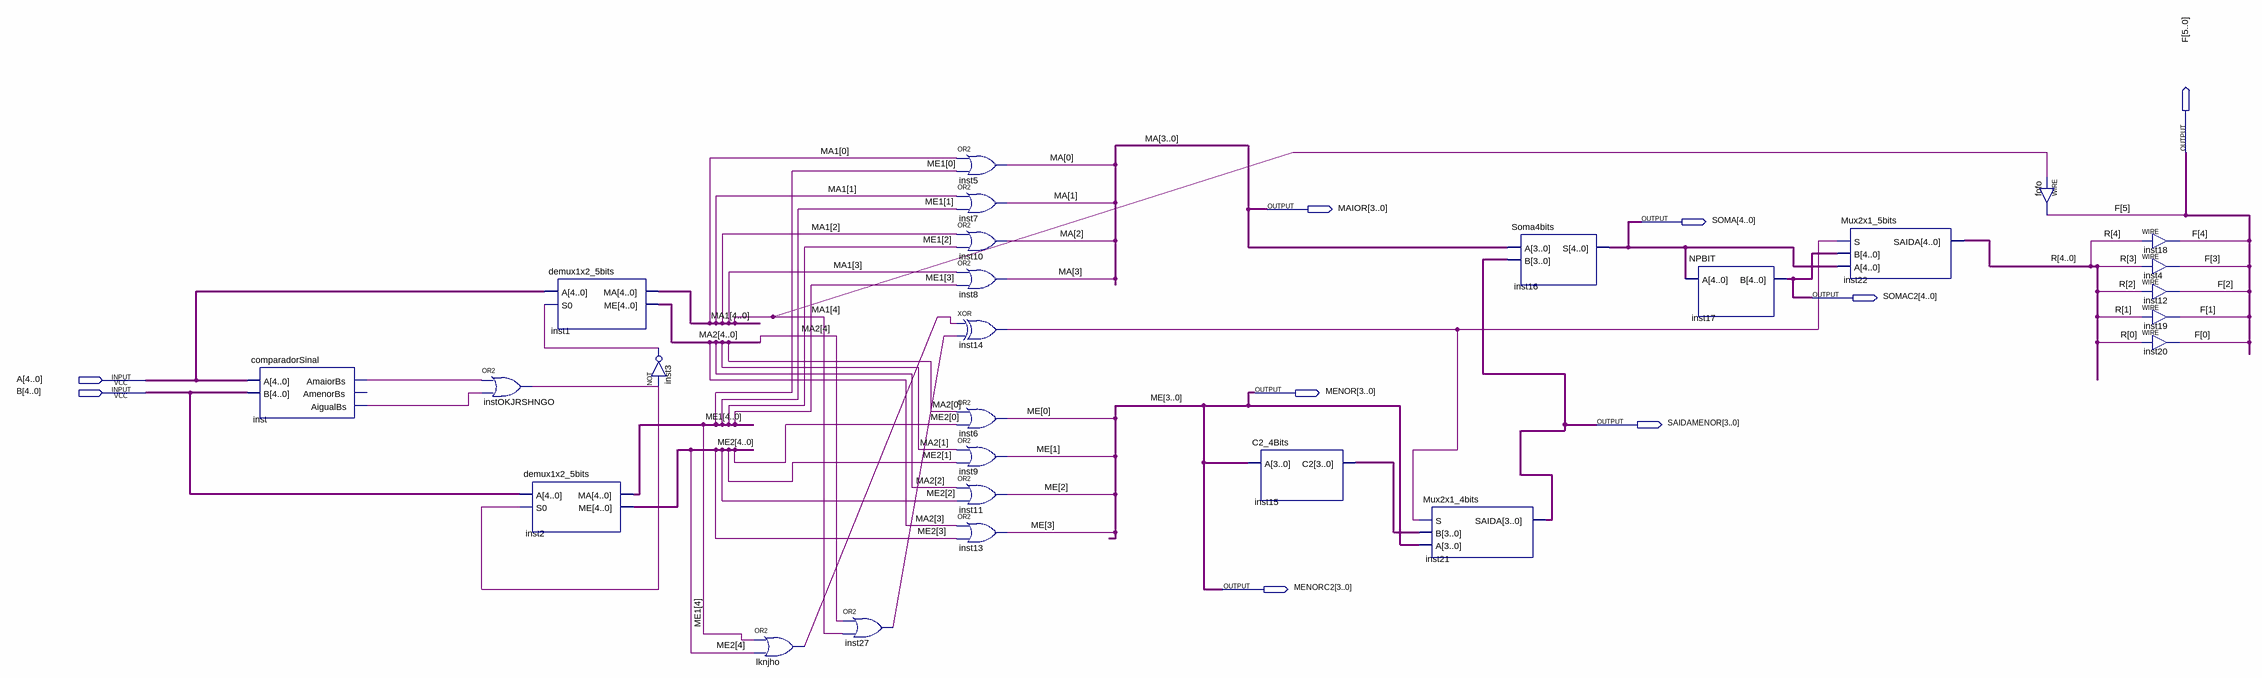
[diagram p0: schematic sheet]
// Quartus schematic Somador.bdf as structural Verilog: 27 symbols, 9 pins
module Somador (
  input  [4:0] A,
  input  [4:0] B,
  output [5:0] F,
  output [3:0] MAIOR,
  output [4:0] SOMA,
  output [4:0] SOMAC2,
  output [3:0] MENOR,
  output [3:0] SAIDAMENOR,
  output [3:0] MENORC2
);

  wire inst3_out, inst14_out, inst27_out, inst_aigualbs, inst_amaiorbs, instOKJRSHNGO_out, lknjho_out;
  wire [3:0] inst15_c2;
  wire [4:0] MA1, MA2, ME1, ME2, R;

  comparadorSinal inst (.A(A), .B(B), .AmaiorBs(inst_amaiorbs), .AigualBs(inst_aigualbs));  // open: AmenorBs
  or instOKJRSHNGO (instOKJRSHNGO_out, inst_amaiorbs, inst_aigualbs);
  demux1x2_5bits inst2 (.A(B), .S0(instOKJRSHNGO_out), .MA(ME1), .ME(ME2));
  demux1x2_5bits inst1 (.A(A), .S0(inst3_out), .MA(MA1), .ME(MA2));
  not inst3 (inst3_out, instOKJRSHNGO_out);
  or lknjho (lknjho_out, ME1[4], ME2[4]);
  or inst27 (inst27_out, MA2[4], MA1[4]);
  or inst5 (MAIOR[0], MA1[0], ME1[0]);
  or inst7 (MAIOR[1], MA1[1], ME1[1]);
  or inst10 (MAIOR[2], MA1[2], ME1[2]);
  or inst8 (MAIOR[3], MA1[3], ME1[3]);
  xor inst14 (inst14_out, lknjho_out, inst27_out);
  or inst6 (MENOR[0], MA2[0], ME2[0]);
  or inst9 (MENOR[1], MA2[1], ME2[1]);
  or inst11 (MENOR[2], MA2[2], ME2[2]);
  or inst13 (MENOR[3], MA2[3], ME2[3]);
  C2_4Bits inst15 (.A(MENOR), .C2(inst15_c2));
  Mux2x1_4bits inst21 (.S(inst14_out), .B(inst15_c2), .A(MENOR), .SAIDA(SAIDAMENOR));
  Soma4bits inst16 (.A(MAIOR), .B(SAIDAMENOR), .S(SOMA));
  NPBIT inst17 (.A(SOMA), .B(SOMAC2));
  Mux2x1_5bits inst22 (.S(inst14_out), .B(SOMAC2), .A(SOMA), .SAIDA(R));
  assign F[5] = MA1[4];  // WIRE fofo
  assign F[4] = R[4];  // WIRE inst18
  assign F[3] = R[3];  // WIRE inst4
  assign F[2] = R[2];  // WIRE inst12
  assign F[1] = R[1];  // WIRE inst19
  assign F[0] = R[0];  // WIRE inst20

  assign MENORC2 = MENOR;

  // Other names for the same wires on the sheet: MA[3:0] = MAIOR; ME[3:0] = MENOR
endmodule
